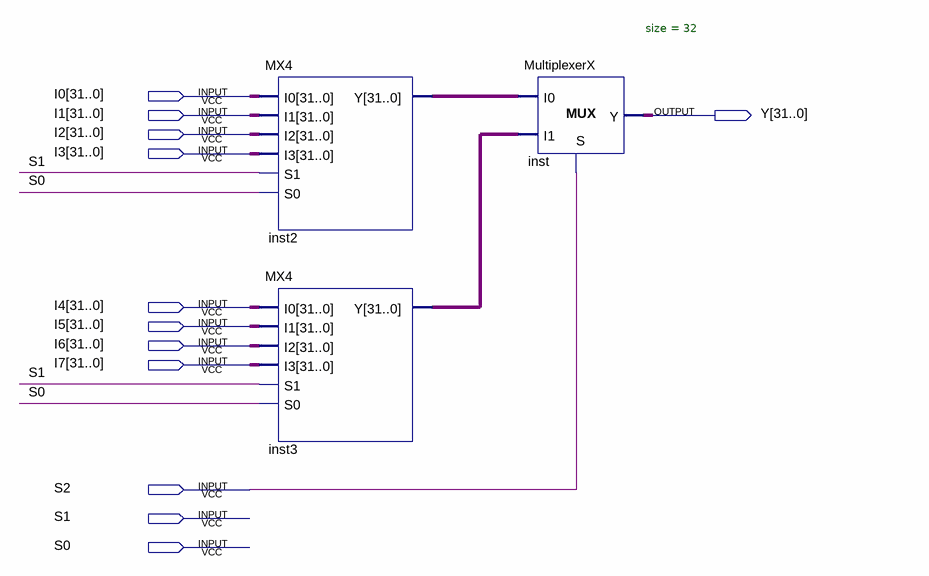
[diagram p0: schematic sheet]
// Quartus schematic MX8.bdf as structural Verilog: 3 symbols, 12 pins
module MX8 (
  input  [31:0] I0,
  input  [31:0] I1,
  input  [31:0] I2,
  input  [31:0] I3,
  input  [31:0] I4,
  input  [31:0] I5,
  input  [31:0] I6,
  input  [31:0] I7,
  input  S2,
  input  S1,
  input  S0,
  output [31:0] Y
);

  wire [31:0] inst2_y, inst3_y;

  MX4 inst2 (.I0(I0), .I1(I1), .I2(I2), .I3(I3), .S1(S1), .S0(S0), .Y(inst2_y));
  MX4 inst3 (.I0(I4), .I1(I5), .I2(I6), .I3(I7), .S1(S1), .S0(S0), .Y(inst3_y));
  MultiplexerX #(.size(32)) inst (.S(S2), .I0(inst2_y), .I1(inst3_y), .Y(Y));
endmodule
